# Altium schematic sheet 1_Power_Supply.SchDoc
size A; SheetNumber: 1; SheetTotal: 5
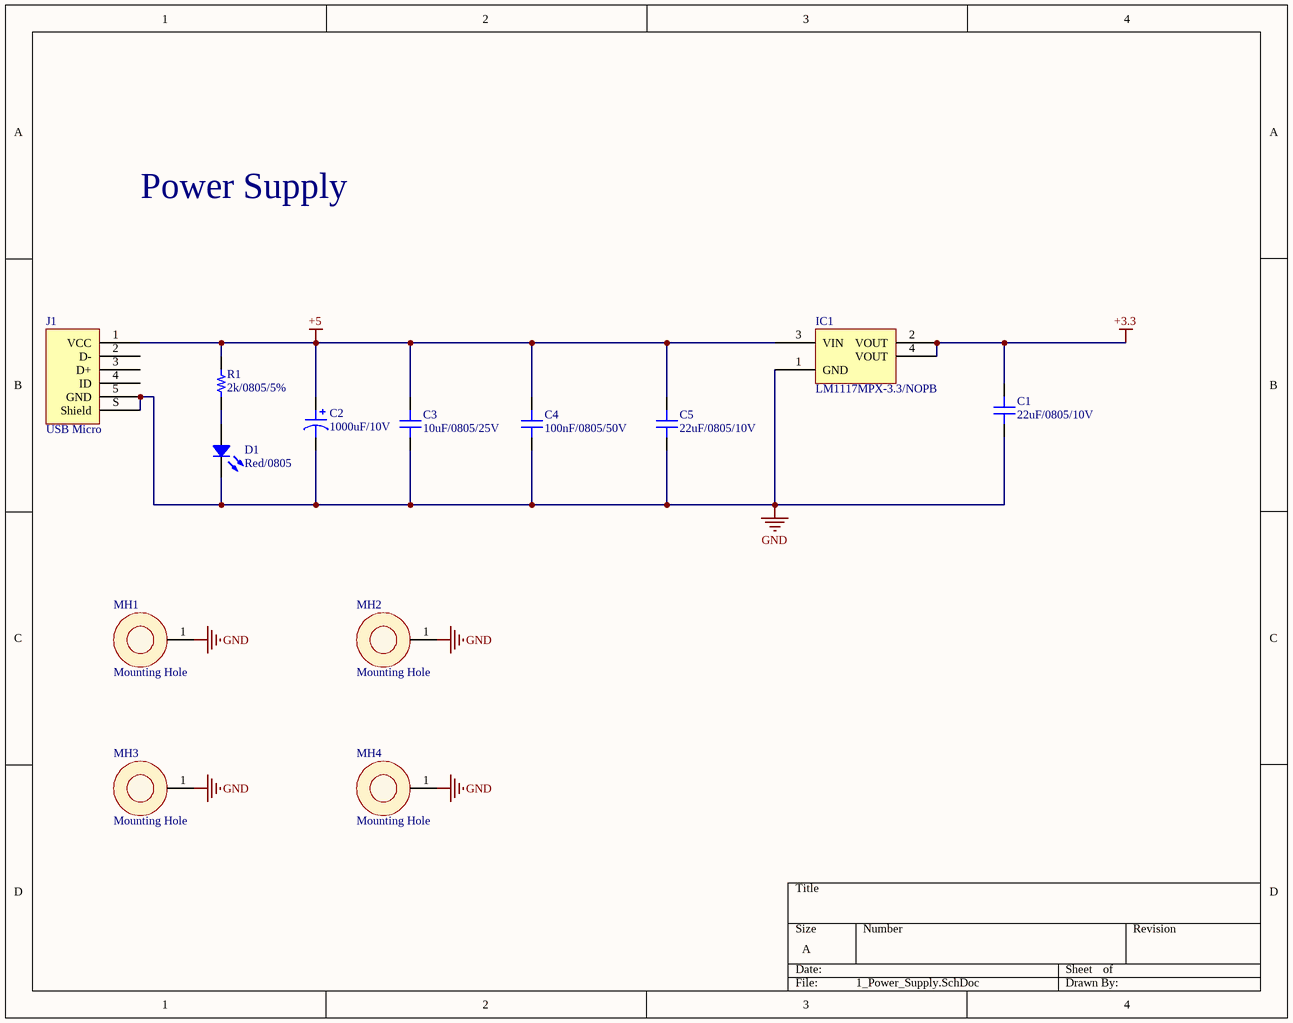
[diagram p0: 1_Power_Supply.SchDoc]

## Parts
C1  22uF/0805/10V  [CAP 0805_2012]
C2  1000uF/10V  [CAP ALSMD 4.3MM H5.4MM]
C3  10uF/0805/25V  [CAP FILM 0805]
C4  100nF/0805/50V  [CAP FILM 0805]
C5  22uF/0805/10V  [CAP 0805_2012]
D1  Red/0805  [LED 0805_2012 RED]
IC1  LM1117MPX-3.3/NOPB  [TI SOT-223 DCY]
J1  USB Micro  [FCI USB 10118193-0001LF]
MH1  Mounting Hole  [M3_Hole]  (no BOM)
MH2  Mounting Hole  [M3_Hole]  (no BOM)
MH3  Mounting Hole  [M3_Hole]  (no BOM)
MH4  Mounting Hole  [M3_Hole]  (no BOM)
R1  2k/0805/5%  [RES 0805_2012]

## Nets
+3.3: C1.1 IC1.2(VOUT) IC1.4(VOUT)
+5: C2.1 C3.2 C4.2 C5.1 IC1.3(VIN) J1.1(VCC) R1.2
GND: C1.2 C2.2 C3.1 C4.1 C5.2 D1.2 IC1.1(GND) J1.5(GND) J1.S(Shield) MH1.1(FG) MH2.1(FG) MH3.1(FG) MH4.1(FG)
NetD1_1: D1.1 R1.1

Not connected (* = marked no-connect by the designer): J1 2(D-) 3(D+) 4(ID)

## Notes on the sheet
- Power Supply

## Library data of the parts
C1 C5 = Capacitor - MLCC: Multilayer Ceramic Capacitor, 22 uF, 10 V, ± 20%, X5R, 0805 [2012 Metric]; Manufacturer: Samsung; Manufacturer Part Number: CL21A226MPQNNNE; Capacitance: 22uF; Voltage Rating: 10V; Supplier 1: Avnet; Supplier Part Number 1: CL21A226MPQNNNE; RoHS: Yes; Category: Ceramic Capacitors; Stock 1: 8000; Pricing 1: 2000=0.01584, 4000=0.01548, 8000=0.01511, 12000=0.01474, 16000=0.01438 (USD); Mount: Surface Mount; Case/Package: 0805; Case Code (Metric): 2012; Case Code (Imperial): 0805; Min Operating Temperature: -55°C; Max Operating Temperature: 85°C; Package Quantity: 1; Packaging: Cut Tape; Tolerance: 20%; Voltage Rating (DC): 10V; Series: CL; Length: 0.079inch; Width: 0.049inch; Thickness: 0.053inch; Lead Free: Lead Free; RoHS Compliant: Yes; ComponentLink1URL: https://datasheet.ciiva.com/25721/cl21a226mpqnnne-25721488.pdf?src-supplier=Digikey; ComponentLink1Description: https://datasheet.ciiva.com/25721/cl21a226mpqnnne-25721488.pdf?src-supplier=Digikey
C2 = Capacitor - Aluminum: Aluminum Electrolytic Capacitor, 1000 uF, 10 V, ± 20%, 1000 hours @ 105°C, Radial Can - SMD; Manufacturer: Panasonic; Manufacturer Part Number: EEE-HA1A102P; Supplier 1: Mouser; Supplier Part Number 1: 667-EEE-HA1A102P; RoHS: Yes; Category: Aluminum Electrolytic Capacitors; Stock 1: 370; Pricing 1: 1=0.63, 10=0.405, 50=0.405, 100=0.329, 1000=0.217, 10000=0.197 (USD); ComponentLink1URL: https://datasheet.ciiva.com/92/aba0000ce3-92032.pdf?src-supplier=Digikey; ComponentLink1Description: https://datasheet.ciiva.com/92/aba0000ce3-92032.pdf?src-supplier=Digikey; ComponentLink2URL: https://datasheet.ciiva.com/92/aba0000ce3-92033.pdf?src-supplier=Digikey; ComponentLink2Description: https://datasheet.ciiva.com/92/aba0000ce3-92033.pdf?src-supplier=Digikey; ComponentLink3URL: https://datasheet.ciiva.com/11777/0900766b8102e3f9-11777407.pdf?src-supplier=Rs; ComponentLink3Description: https://datasheet.ciiva.com/11777/0900766b8102e3f9-11777407.pdf?src-supplier=Rs; ComponentLink4URL: https://datasheet.ciiva.com/16433/aba0000ce3-16433432.pdf?src-supplier=Future+Electronics; ComponentLink4Description: https://datasheet.ciiva.com/16433/aba0000ce3-16433432.pdf?src-supplier=Future+Electronics; ComponentLink5URL: https://datasheet.ciiva.com/43459/1446029-43459814.pdf?src-supplier=Farnell; ComponentLink5Description: https://datasheet.ciiva.com/43459/1446029-43459814.pdf?src-supplier=Farnell; ComponentLink6URL: https://datasheet.ciiva.com/24228/aba0000ce3-259063-24228124.pdf?src-supplier=Mouser; ComponentLink6Description: https://datasheet.ciiva.com/24228/aba0000ce3-259063-24228124.pdf?src-supplier=Mouser; ComponentLink7URL: https://datasheet.ciiva.com/92/aba0000ce3-92031.pdf?src-supplier=Digikey; ComponentLink7Description: https://datasheet.ciiva.com/92/aba0000ce3-92031.pdf?src-supplier=Digikey; ComponentLink8URL: https://datasheet.ciiva.com/2985/aba0000ce3-2985629.pdf?src-supplier=Avnet; ComponentLink8Description: https://datasheet.ciiva.com/2985/aba0000ce3-2985629.pdf?src-supplier=Avnet; ComponentLink9URL: https://datasheet.ciiva.com/30100/33aba0000ce3-30100694.pdf?src-supplier=Onlinecomponents.com; ComponentLink9Description: https://datasheet.ciiva.com/30100/33aba0000ce3-30100694.pdf?src-supplier=Onlinecomponents.com; ComponentLink10URL: https://datasheet.ciiva.com/14597/70256712-14597160.pdf?src-supplier=Allied+Electronics; ComponentLink10Description: https://datasheet.ciiva.com/14597/70256712-14597160.pdf?src-supplier=Allied+Electronics; ComponentLink11URL: https://datasheet.ciiva.com/46386/1446029-46386671.pdf?src-supplier=Element14; ComponentLink11Description: https://datasheet.ciiva.com/46386/1446029-46386671.pdf?src-supplier=Element14; ComponentLink12URL: https://datasheet.ciiva.com/6012/1446029-6012554.pdf?src-supplier=Farnell; ComponentLink12Description: https://datasheet.ciiva.com/6012/1446029-6012554.pdf?src-supplier=Farnell; Value: 1000uF/10V
C3 = Capacitor - MLCC: Multilayer Ceramic Capacitor, 10 uF, 25 V, ï¿½ 10%, X5R, 0805 [2012 Metric]; Manufacturer: Samsung; Manufacturer Part Number: CL21A106KAYNNNE; Capacitance: 10uF; Voltage Rating: 25V; Supplier 1: Avnet; Supplier Part Number 1: CL21A106KAYNNNE; RoHS: Yes; Category: Ceramic Capacitors; Stock 1: 1478000; Pricing 1: 2000=0.00778 (USD); Mount: Surface Mount; Case/Package: 0805; Case Code (Metric): 2012; Case Code (Imperial): 0805; Material: Ceramic; Min Operating Temperature: -55°C; Max Operating Temperature: 85°C; Package Quantity: 1; Packaging: Tape and Reel; Tolerance: 10%; Dielectric: X5R; Series: CL; Construction: Flat; Voltage Rating (DC): 25V; Length: 2mm; Width: 0.049inch; Height: 1.25mm; Thickness: 0.057inch; Depth: 1.25mm; Radiation Hardening: No; RoHS Compliant: Yes; ComponentLink1URL: https://datasheet.ciiva.com/25796/cl21a106kaynnne-25796720.pdf?src-supplier=Digikey; ComponentLink1Description: https://datasheet.ciiva.com/25796/cl21a106kaynnne-25796720.pdf?src-supplier=Digikey; ComponentLink2URL: https://datasheet.ciiva.com/26838/getdatasheetpartid-357558-26838583.pdf?src-supplier=Verical; ComponentLink2Description: https://datasheet.ciiva.com/26838/getdatasheetpartid-357558-26838583.pdf?src-supplier=Verical
C4 = Capacitor - MLCC: Multilayer Ceramic Capacitor, 0.1 uF, 50 V, ï¿½ 10%, X7R, 0805 [2012 Metric]; Manufacturer: Samsung; Manufacturer Part Number: CL21B104KBCNNNC; Capacitance: 100nF; Voltage Rating: 50V; Supplier 1: Avnet; Supplier Part Number 1: CL21B104KBCNNNC; RoHS: Yes; Category: Ceramic Capacitors; Stock 1: 850000; Pricing 1: 4000=0.0097, 8000=0.00455, 16000=0.00444, 24000=0.00434, 32000=0.00423 (USD); Mount: Surface Mount; Case/Package: 0805; Case Code (Metric): 2012; Case Code (Imperial): 0805; Material: Ceramic; Min Operating Temperature: -55°C; Max Operating Temperature: 125°C; Tolerance: 10%; Dielectric: X7R; Packaging: Tape and Reel; Voltage: 50V; Series: CL; Construction: Flat; Voltage Rating (DC): 50V; Length: 2mm; Width: 0.049inch; Height: 0.85mm; Depth: 1.25mm; Thickness: 0.037inch; Radiation Hardening: No; RoHS Compliant: Yes; Lead Free: 5697LeadFree; ComponentLink1URL: https://datasheet.ciiva.com/25710/cl21b104kbcnnnc-25710182.pdf?src-supplier=Digikey; ComponentLink1Description: https://datasheet.ciiva.com/25710/cl21b104kbcnnnc-25710182.pdf?src-supplier=Digikey; ComponentLink2URL: https://datasheet.ciiva.com/29199/454152-da-01-en-vs-kondensator-0805-29199814.pdf?src-supplier=Conrad; ComponentLink2Description: https://datasheet.ciiva.com/29199/454152-da-01-en-vs-kondensator-0805-29199814.pdf?src-supplier=Conrad
D1 = LED: LED Uni-Color Red 2-Pin Chip 0805(2012Metric) T/R; Manufacturer: Rohm; Manufacturer Part Number: SML-H12U8TT86; Supplier 1: Mouser; Supplier Part Number 1: 755-SML-H12U8TT86; RoHS: Yes; Category: LEDs; Stock 1: 208; Pricing 1: 1=0.66, 10=0.393, 50=0.393, 100=0.204, 1000=0.185, 10000=0.157 (USD); ComponentLink1URL: http://www.mouser.com/ds/2/348/sml-h1-313836.pdf?src-supplier=Mouser; ComponentLink1Description: http://www.mouser.com/ds/2/348/sml-h1-313836.pdf?src-supplier=Mouser; ComponentLink2URL: http://www.farnell.com/datasheets/2292365.pdf?src-supplier=Farnell; ComponentLink2Description: http://www.farnell.com/datasheets/2292365.pdf?src-supplier=Farnell; ComponentLink3URL: https://datasheet.octopart.com/SML-H12U8TT86-Rohm-datasheet-61210011.pdf?src-supplier=Element14; ComponentLink3Description: https://datasheet.octopart.com/SML-H12U8TT86-Rohm-datasheet-61210011.pdf?src-supplier=Element14; ComponentLink4URL: https://www.rohm.com/datasheet/SML-H12M8T?src-supplier=Digikey; ComponentLink4Description: https://www.rohm.com/datasheet/SML-H12M8T?src-supplier=Digikey; ComponentLink5URL: https://datasheet.octopart.com/SML-H12U8TT86-Rohm-datasheet-68298519.pdf?src-supplier=Future+Electronics; ComponentLink5Description: https://datasheet.octopart.com/SML-H12U8TT86-Rohm-datasheet-68298519.pdf?src-supplier=Future+Electronics; ComponentLink6URL: https://datasheet.octopart.com/SML-H12U8TT86-Rohm-datasheet-142144718.pdf?src-supplier=TME; ComponentLink6Description: https://datasheet.octopart.com/SML-H12U8TT86-Rohm-datasheet-142144718.pdf?src-supplier=TME; Value: Red/0805
IC1 = LM1117IMP/NOPB: 800-mA 15-V linear voltage regulator ; 4-SOT-223 0 to 125; Manufacturer: Texas Instruments; Number of Channels: 1NUMBER; Min Current Limit: 800mA; Supplier 1: Mouser; Supplier Part Number 1: 926-LM1117MPX3.3NOPB; Manufacturer Part Number: LM1117MPX-3.3/NOPB; RoHS: Yes; Category: Voltage Regulators - Linear; Stock 1: 40334; Pricing 1: 1=0.99, 10=0.65, 50=0.65, 100=0.529, 1000=0.49, 10000=0.452 (USD); Thickness: 1.6mm; Radiation Hardening: 5898YesNo; Lead Free: 5697LeadFree
J1 = USB 2.0 Type B Micro
R1 = Resistor: Res Thin Film 0805 2K Ohm 0.1% 0.125W(1/8W) ±25ppm/C Pad SMD T/R; Manufacturer: Yageo; Manufacturer Part Number: RT0805BRD072KL; Voltage Rating (DC): 150V; Tolerance: 5%; Supplier 1: Future Electronics; Supplier Part Number 1: 9309717; RoHS: Yes; Category: Chip SMD Resistors; Stock 1: 35000; Pricing 1: 5000=0.0215, 15000=0.0207, 25000=0.0203, 75000=0.0196, 125000=0.019 (USD); Lead Free: 5697LeadFree; ComponentLink1URL: https://datasheet.ciiva.com/12836/pyu-rt-1-to-0-05-rohs-l-4-12836431.pdf?src-supplier=Mouser; ComponentLink1Description: https://datasheet.ciiva.com/12836/pyu-rt-1-to-0-05-rohs-l-4-12836431.pdf?src-supplier=Mouser; ComponentLink2URL: https://datasheet.ciiva.com/8894/pyu-rt-1-to-0-05-rohs-l-4-8894822.pdf?src-supplier=Avnet; ComponentLink2Description: https://datasheet.ciiva.com/8894/pyu-rt-1-to-0-05-rohs-l-4-8894822.pdf?src-supplier=Avnet; ComponentLink3URL: https://datasheet.ciiva.com/2584/pyu-rt-1-to-0-05-rohs-l-4-2584929.pdf?src-supplier=Digikey; ComponentLink3Description: https://datasheet.ciiva.com/2584/pyu-rt-1-to-0-05-rohs-l-4-2584929.pdf?src-supplier=Digikey; ComponentLink4URL: https://datasheet.ciiva.com/46634/pyu-rt-1-to-0-05-rohs-l-5-46634903.pdf?src-supplier=Digikey; ComponentLink4Description: https://datasheet.ciiva.com/46634/pyu-rt-1-to-0-05-rohs-l-5-46634903.pdf?src-supplier=Digikey; Resistance: 2k; Case/Package: 0805